# Altium schematic sheet SPI.SCHDOC: Apalis Evaluation Board 1.1
size A3; Organization: Toradex AG; Address1: Altsagenstrasse 5; Address2: Horw; Address3: 6048; Address4: Switzerland; DocumentNumber: 28; Revision: V1.1; SheetNumber: 28; SheetTotal: 32; PageSetup: Record=PageOptions|CenterHorizontal=True|CenterVertical=True|PrintScale=0.73|XCorrection=1.00|YCorrection=1.00|PrintKind=0|BorderSize=5000000|LeftOffset=0|BottomOffset=0|Orientation=2|PaperLength=1000|PaperWidth=1000|Scale=100|PaperSource=7|PrintQuality=-4|MediaType=1|DitherType=10|PaperKind=A4|PrintScaleMode=1
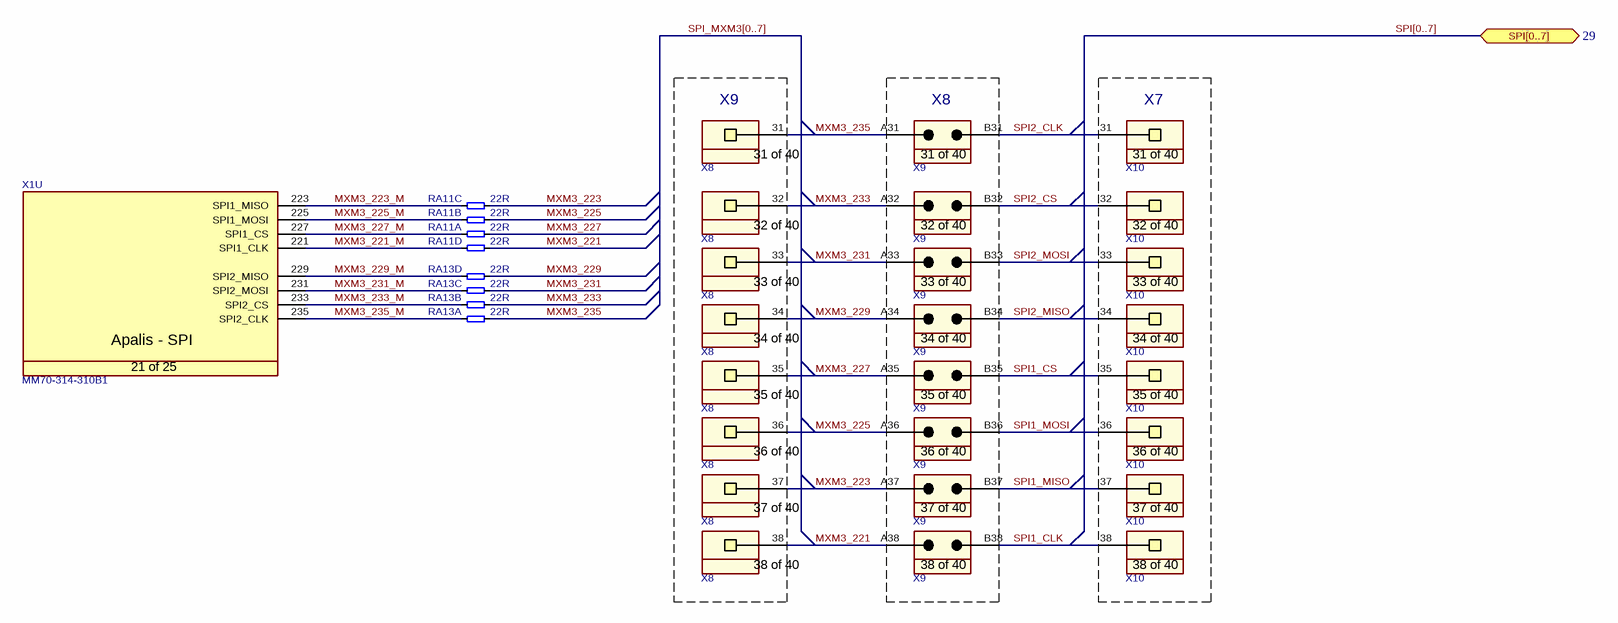
[diagram p0: SPI.SCHDOC]

## Parts
RA11  22R  [T_Resistor_Array_X4]  (parts A,B,C,D of 4)
RA13  22R  [T_Resistor_Array_X4]  (parts A,B,C,D of 4)
X1  Manufacturer Part No.: MM70-314-310B1  [T_JAE_MM70-314-310B1]  (hidden comment: CON-JAE-MM70-314-310B1-314-0.5mm)  (part U of 25)
X8  SSW-110-01-G-S  [T_Samtec_SSW-110-01-G-S]  (value not drawn)  (parts 31,32,33,34,35,36,37,38 of 40)
X9  TSW-110-07-G-D  [T_Samtec_TSW-110-07-G-D]  (value not drawn)  (parts 31,32,33,34,35,36,37,38 of 40)
X10  SSW-110-01-G-S  [T_Samtec_SSW-110-01-G-S]  (value not drawn)  (parts 31,32,33,34,35,36,37,38 of 40)

## Blocks framed on the sheet
X9: X8
X8: X9
X7: X10

## Ports
SPI[0..7] (bidir, see 29)

## Nets
MXM3_221: RA11.8 X8.38 X9.A38
MXM3_221_M: RA11.4 X1.221(SPI1_CLK)
MXM3_223: RA11.7 X8.37 X9.A37
MXM3_223_M: RA11.3 X1.223(SPI1_MISO)
MXM3_225: RA11.6 X8.36 X9.A36
MXM3_225_M: RA11.2 X1.225(SPI1_MOSI)
MXM3_227: RA11.5 X8.35 X9.A35
MXM3_227_M: RA11.1 X1.227(SPI1_CS)
MXM3_229: RA13.8 X8.34 X9.A34
MXM3_229_M: RA13.4 X1.229(SPI2_MISO)
MXM3_231: RA13.7 X8.33 X9.A33
MXM3_231_M: RA13.3 X1.231(SPI2_MOSI)
MXM3_233: RA13.6 X8.32 X9.A32
MXM3_233_M: RA13.2 X1.233(SPI2_CS)
MXM3_235: RA13.5 X8.31 X9.A31
MXM3_235_M: RA13.1 X1.235(SPI2_CLK)
SPI1_CLK: X9.B38 X10.38
SPI1_CS: X9.B35 X10.35
SPI1_MISO: X9.B37 X10.37
SPI1_MOSI: X9.B36 X10.36
SPI2_CLK: X9.B31 X10.31
SPI2_CS: X9.B32 X10.32
SPI2_MISO: X9.B34 X10.34
SPI2_MOSI: X9.B33 X10.33

## Buses and harness runs
bus SPI[0..7] = port SPI[0..7]
bus SPI_MXM3[0..7]

## Notes on the sheet
- Title
- Size:
- Date:
- A3
- Number:
- Time:
- Revision:
- Sheet
- of
- File:
- (in symbol CON-JAE-MM70-314-310B1-314-0.5mm, part U) Apalis - SPI; 21 of 25
- (in symbol CON-Samtec-SSW-110-01-G-S, part 31) 31 of 40
- (in symbol CON-Samtec-SSW-110-01-G-S, part 32) 32 of 40
- (in symbol CON-Samtec-SSW-110-01-G-S, part 33) 33 of 40
- (in symbol CON-Samtec-SSW-110-01-G-S, part 34) 34 of 40
- (in symbol CON-Samtec-SSW-110-01-G-S, part 35) 35 of 40
- (in symbol CON-Samtec-SSW-110-01-G-S, part 36) 36 of 40
- (in symbol CON-Samtec-SSW-110-01-G-S, part 37) 37 of 40
- (in symbol CON-Samtec-SSW-110-01-G-S, part 38) 38 of 40
- (in symbol CON-Samtec-TSW-110-07-G-D, part 31) 31 of 40
- (in symbol CON-Samtec-TSW-110-07-G-D, part 32) 32 of 40
- (in symbol CON-Samtec-TSW-110-07-G-D, part 33) 33 of 40
- (in symbol CON-Samtec-TSW-110-07-G-D, part 34) 34 of 40
- (in symbol CON-Samtec-TSW-110-07-G-D, part 35) 35 of 40
- (in symbol CON-Samtec-TSW-110-07-G-D, part 36) 36 of 40
- (in symbol CON-Samtec-TSW-110-07-G-D, part 37) 37 of 40
- (in symbol CON-Samtec-TSW-110-07-G-D, part 38) 38 of 40

## Library data of the parts
RA11 RA13 = RA-22R-63mW-5%-1206-div: Resistor Array 22 R 63mW 5% 1206; Tolerance: 5%; Power Dissipation: 63mW; Value: 22R
X1 = CON-JAE-MM70-314-310B1-314-0.5mm: MXM3 Connector; Manufacturer Name: JAE; No. of ways: 314
X8 X10 = CON-Samtec-SSW-110-01-G-S: Receptacle Female Socket 1x40 pin 2.54mm pitch; Manufacturer Name: Samtec; Pitch: 2.54mm; No. of ways: 1x40; Manufacturer Part No.: SSW-110-01-G-S
X9 = CON-Samtec-TSW-110-07-G-D: Header 2x40 pin 2.54mm pitch; Manufacturer Name: Samtec; Pitch: 2.54mm; No. of ways: 2x40; Manufacturer Part No.: TSW-110-07-G-D